# EAGLE design encoder (EAGLE 4.15)
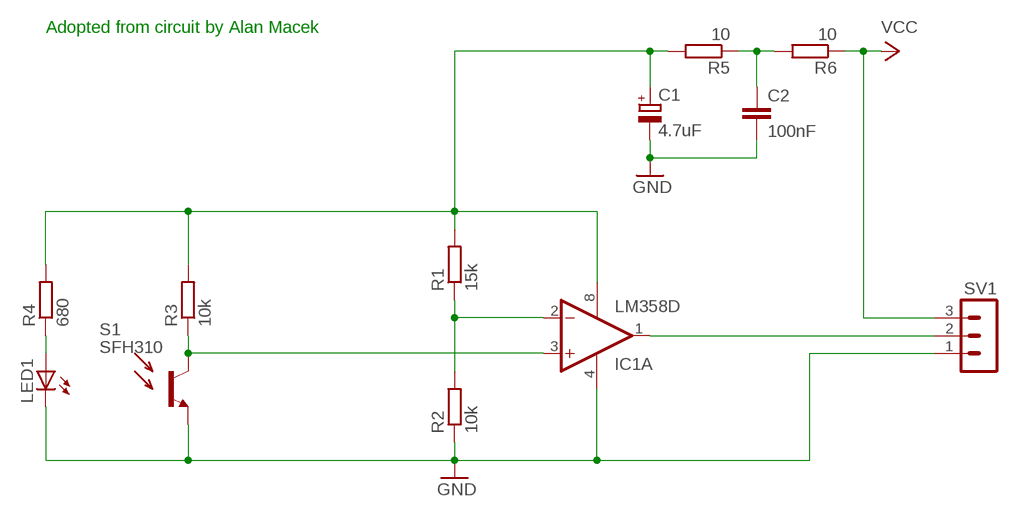
[diagram p0: schematic, sheet 1]

## Parts
C1  4.7uF  CPOL-EUC/6032-28R  [C/6032-28R]
C2  100nF  C-EUC0805  [C0805]
IC1  LM358D  [SO08]
LED1  LED3MM  [LED3MM]
R1  15k  R-EU_M0805  [M0805]
R2  10k  R-EU_M0805  [M0805]
R3  10k  R-EU_M0805  [M0805]
R4  680  R-EU_M0805  [M0805]
R5  10  R-EU_M0805  [M0805]
R6  10  R-EU_M0805  [M0805]
S1  SFH310  [LED3MM]
SV1  MA03-1  [MA03-1]

## Nets
GND: C1.- C2.2 IC1.4(P:V-) LED1.K(C) R2.1 S1.K(E) SV1.1
N$1: IC1.3(A:+IN) R3.1 S1.A(C)
N$2: C2.1 R5.1 R6.2
N$4: LED1.A R4.1
N$7: IC1.2(A:-IN) R1.1 R2.2
N$8: IC1.1(A:OUT) SV1.2
V+: C1.+ IC1.8(P:V+) R1.2 R3.2 R4.2 R5.2
VCC: R6.1 SV1.3
Unconnected: IC1.5(B:+IN) IC1.6(B:-IN) IC1.7(B:OUT)

## Notes on the sheet
- Adopted from circuit by Alan Macek

## Library data of the parts
C1 = rcl:CPOL-EU: POLARIZED CAPACITOR, European symbol
C2 = rcl:C-EU: CAPACITOR, European symbol
IC1 = linear:LM358: OP AMP
LED1 = 0-svo:LED: LED OSRAM: - CHIPLED LG R971, LG N971, LY N971, LG Q971, LY Q971, LO R971, LY R971 LH N974, LH R974 LS Q976, LO Q976, LY Q976 LO Q996 - Hyper CHIPLED LW Q18S LB Q993, LB Q99A, LB R99A - SideLED LS A670, LO A670, LY A670, LG A670, LP A670 LB A673, LV A673, LT A673, LW A673 LH A674 LY A675 LS A676, LA A676, LO A676, LY A676, LW A676 LS A679, LY A679, LG A679 - Hyper Micro SIDELED® LS Y876, LA Y876, LO Y876, LY Y876 LT Y87S - SmartLED LW L88C, LW L88S LB L89C, LB L89S, LG L890 LS L89K, LO L89K, LY L89K LS L896, LA L896, LO L896, LY L896 - TOPLED LS T670, LO T670, LY T670, LG T670, LP T670 LSG T670, LSP T670, LSY T670, LOP T670, LYG T670 LG T671, LOG T671, LSG T671 LB T673, LV T673, LT T673, LW T673 LH T674 LS T676, LA T676, LO T676, LY T676, LB T676, LH T676, LSB T676, LW T676 LB T67C, LV T67C, LT T67C, LS T67K, LO T67K, LY T67K, LW E67C LS E67B, LA E67B, LO E67B, LY E67B, LB E67C, LV E67C, LT E67C LW T67C LS T679, LY T679, LG T679 LS T770, LO T770, LY T770, LG T770, LP T770 LB T773, LV T773, LT T773, LW T773 LH T774 LS E675, LA E675, LY E675, LS T675 LS T776, LA T776, LO T776, LY T776, LB T776 LHGB T686 LT T68C, LB T68C - Hyper Mini TOPLED® LB M676 - Mini TOPLED Santana® LG M470 LS M47K, LO M47K, LY M47K Source: http://www.osram.convergy.de/
R1-R6 = rcl:R-EU_: RESISTOR, European symbol
S1 = 0-svo:SFH310
SV1 = con-lstb:MA03-1: PIN HEADER

## Board
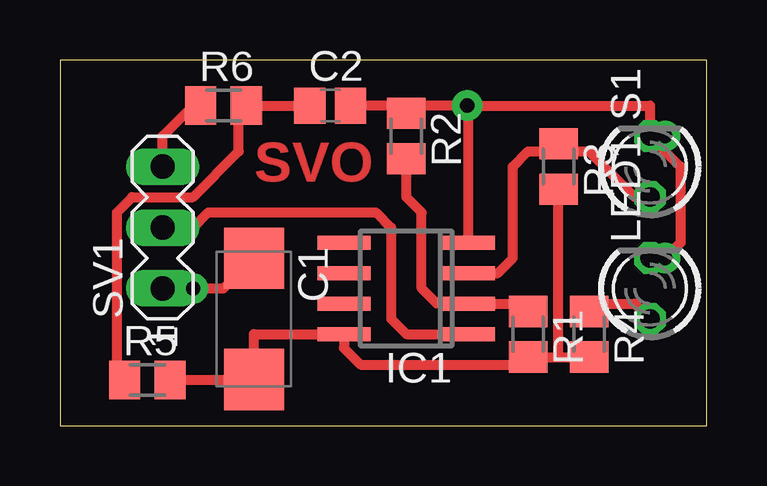
[diagram p1: board, top side]
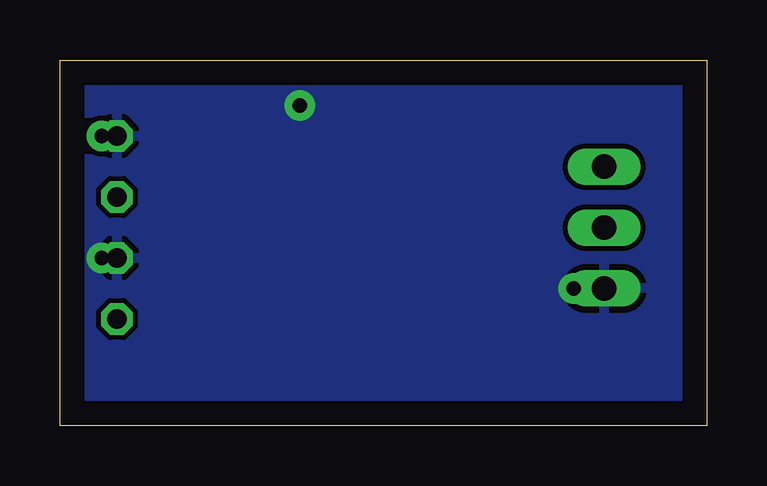
[diagram p2: board, bottom side, seen from below]

Size 26.97 x 15.23 mm. Coordinates in mm from the lower left corner, seen from the top.
Outline: 0,0 26.97,0 26.97,15.23 0,15.23 0,0
Copper layers (1*16): Top 0.035mm / dielectric 1.5mm / Bottom 0.035mm
Design rules "default": minimum track width 10mil, minimum drill 24mil, track to track 8mil, track to pad 8mil, pad to pad 8mil, via to via 8mil, smd to smd 8mil, copper to edge 40mil, drill to drill 8mil, minimum pad ring 10mil, minimum via ring 8mil, stop-mask expansion 4mil, vias tented up to drill 0mil, thermal gap 10mil

### Footprints (pad centres in the part's own frame; a part is rotated, then mirrored left to right if it is on the bottom)
C/6032-28R = smd 2.55 x 2.5: + 2.525,0; - -2.525,0
C0805 = smd 1.3 x 1.5: 1 -0.85,0; 2 0.85,0
SO08 = smd 0.6 x 2.2: 1 -1.905,-2.6; 2 -0.635,-2.6; 3 0.635,-2.6; 4 1.905,-2.6; 5 1.905,2.6; 6 0.635,2.6; 7 -0.635,2.6; 8 -1.905,2.6
LED3MM = drill 0.813 octagon: A -1.27,0; K 1.27,0
M0805 = smd 1.3 x 1.6: 1 -0.95,0; 2 0.95,0
MA03-1 = drill 1.016 long: 1 -2.54,0; 2 0,0; 3 2.54,0

### Placement (x,y rotation side)
C1  8.09,4.44 270 top
C2  11.27,13.33 0 top
IC1  14.44,5.71 90 top
LED1  24.6,5.71 90 top
R1  19.52,3.8 270 top
R2  14.44,12.06 270 top
R3  20.79,10.79 270 top
R4  22.06,3.8 270 top
R5  3.64,1.9 0 top
R6  6.82,13.33 0 top
S1  24.6,10.79 90 top
SV1  4.28,8.25 90 top

### Tracks (layer width: path | path; a pad name or v marks a point on that pad's centre or on a via)
GND  (via drill 0.6 pad 1.27)
  Top 0.406: 14.44,13.33 C2.2 | 14.44,13.33 R2.1 | v16.98,13.33 14.44,13.33 | SV1.1 v5.55,5.71 6.82,5.71 C1.- 8.09,6.98 | IC1.4 17.04,13.27 v16.98,13.33 | v16.98,13.33 24.6,13.33 S1.K 25.87,10.79 25.87,7.62 v25.23,6.98 LED1.K
  pour Bottom: -0.8,15.87 -0.8,-0.64 28.41,-0.64 28.41,15.87
N$1
  Top 0.406: IC1.3 18.25,6.34 18.88,6.98 18.88,10.79 19.52,11.43 20.79,11.43 | S1.A 23.96,9.52 22.06,11.43 20.79,11.43 | 20.79,11.43 R3.1
N$2
  Top 0.406: 10.63,13.33 C2.1 R6.2 7.46,13.33 7.46,11.43 5.55,9.52 3.01,9.52 2.38,8.89 2.38,2.54 3.01,1.9 R5.1
N$3  (via drill 0.6 pad 1.27)
  other vias: 25.23,12.06
N$4
  Top 0.406: LED1.A 23.96,5.08 22.06,5.08 R4.1
N$7
  Top 0.406: R1.1 19.52,4.44 18.88,5.08 IC1.2 15.71,5.08 15.08,5.71 15.08,8.89 14.44,9.52 R2.2
N$8
  Top 0.406: IC1.1 14.44,3.8 13.81,4.44 13.81,8.25 13.17,8.89 6.18,8.89 5.55,8.25 SV1.2
V+
  Top 0.406: IC1.8 8.09,3.8 C1.+ | IC1.8 11.9,3.8 11.84,3.86 IC1.8 | C1.+ 6.82,1.9 | IC1.8 11.84,3.23 12.54,2.54 19.52,2.54 R1.2 20.79,2.85 | R4.2 22.06,3.17 21.74,2.85 20.79,2.85 | C1.+ 8.09,1.9 R5.2 | 20.79,2.85 R3.2
VCC
  Top 0.406: R6.1 5.55,13.33 4.28,12.06 SV1.3

### Text on the board
Top: SVO